# Altium schematic sheet Sheet.Autolabor.Power.SchDoc
size A4
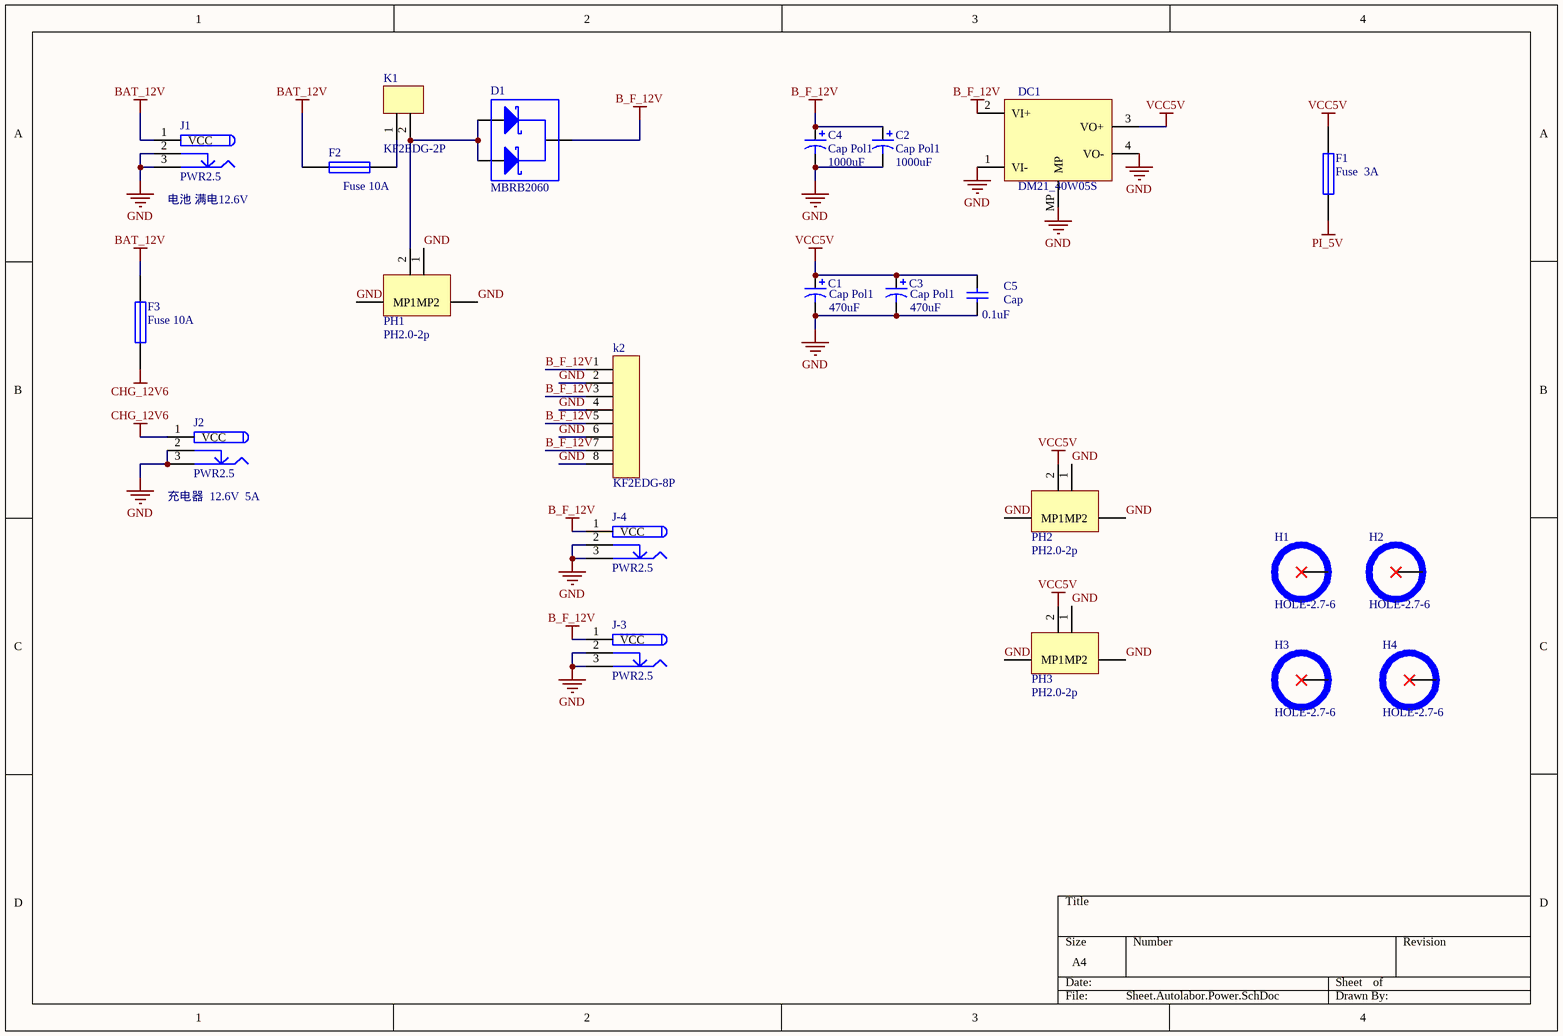
[diagram p0: Sheet.Autolabor.Power.SchDoc]

## Parts
C1  Cap Pol1  value 470uF  [CAPAE8883X102M]
C2  Cap Pol1  value 1000uF  [CAPAE108103X102M]
C3  Cap Pol1  value 470uF  [CAPAE8883X102M]
C4  Cap Pol1  value 1000uF  [CAPAE108103X102M]
C5  Cap  value 0.1uF  [6-0805_L]
D1  MBRB2060  [D2PAK_M]
DC1  DM21_40W05S  [DM21_40W05S-HOLE]
F1  Fuse  3A  [C1206]
F2  Fuse 10A  [C1206]
F3  Fuse 10A  [C1206]
H1  HOLE-2.7-6  [HOLE-2.7-6]
H2  HOLE-2.7-6  [HOLE-2.7-6]
H3  HOLE-2.7-6  [HOLE-2.7-6]
H4  HOLE-2.7-6  [HOLE-2.7-6]
J1  PWR2.5  [KLD-0202-SLOT]
J2  PWR2.5  [KLD-0202-SLOT]
J-3  PWR2.5  [KLD-0202-SLOT]
J-4  PWR2.5  [KLD-0202-SLOT]
K1  KF2EDG-2P  [KF2EDG-3.81-2P]
k2  KF2EDG-8P  [KF2EDG-3.81-8P]
PH1  PH2.0-2p  [PH2.0-LIE-2P]
PH2  PH2.0-2p  [PH2.0-LIE-2P]
PH3  PH2.0-2p  [PH2.0-LIE-2P]

## Nets
B_F_12V: C2.1 C4.1 D1.2(K) DC1.2(VI+) J-3.1(VCC) J-4.1(VCC) k2.1 k2.3 k2.5 k2.7
BAT_12V: F2.1 F3.2 J1.1(VCC)
CHG_12V6: F3.1 J2.1(VCC)
GND: C1.2 C2.2 C3.2 C4.2 C5.1 DC1.1(VI-) DC1.4(VO-) DC1.MP J1.2 J1.3 J2.2 J2.3 J-3.2 J-3.3 J-4.2 J-4.3 k2.2 k2.4 k2.6 k2.8 PH1.1 PH1.MP1 PH1.MP2 PH2.1 PH2.MP1 PH2.MP2 PH3.1 PH3.MP1 PH3.MP2
PI_5V: F1.1
VCC5V: C1.1 C3.1 C5.2 DC1.3(VO+) F1.2 PH2.2 PH3.2
NetD1_1: D1.1(A) D1.3(A) K1.2 PH1.2
NetF2_2: F2.2 K1.1

Not connected (* = marked no-connect by the designer): H1 1*; H2 1*; H3 1*; H4 1*

## Notes on the sheet
- (near J1) 电池 满电12.6V
- (near J2) 充电器  12.6V  5A

## Library data of the parts
C1-C4 = Cap Pol1: Polarized Capacitor (Radial); Published: 8-Jun-2000; LatestRevisionDate: 17-Jul-2002; LatestRevisionNote: Re-released for DXP Platform.; PackageReference: RB7.6-15; Publisher: Altium Limited; PackageDescription: Polarized Capacitor (Radial); 2 Leads
C5 = Cap: Capacitor; Published: 8-Jun-2000; LatestRevisionDate: 17-Jul-2002; LatestRevisionNote: Re-released for DXP Platform.; PackageReference: RAD-0.3; Publisher: Altium Limited; PackageDescription: Radial Cap, Thru-Hole; 2 Leads; 0.3 in Pin Spacing
D1 = Schottky-MBRB: Schottky Diode; Published: 8-Jun-2000; LatestRevisionDate: 17-Jul-2002; LatestRevisionNote: Re-released for DXP Platform.; PackageReference: SMB; Publisher: Altium Limited; PackageDescription: DO-214-AA/SMB; 2 C-Bend Leads; Body 5.3 x 3.6 mm, inc. leads (LxW); Code_JEDEC: DO-214-AA
F1-F3 = Fuse 1: Fuse; Published: 8-Jun-2000; LatestRevisionDate: 17-Jul-2002; LatestRevisionNote: Re-released for DXP Platform.; PackageReference: PIN-W2/E2.8; Publisher: Altium Limited; PackageDescription: Thru-Hole; 2 Leads
J1 J2 J-3 J-4 = PWR2.5: Low Voltage Power Supply Connector; Published: 17-Dec-2003; DatasheetDocument: 09-May-2002; Publisher: Altium Limited; ComponentLink1Description: Manufacturer Link; ComponentLink1URL: http://domino.kycon.com/internet/Products.html